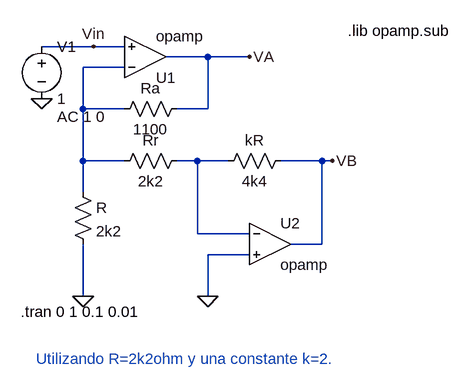
[diagram p0: schematic EJ3.asc]
EJ3.asc, the LTspice schematic file:
Version 4
SHEET 1 880 680
WIRE 96 48 16 48
WIRE 144 48 96 48
WIRE 272 64 208 64
WIRE 336 64 272 64
WIRE 144 80 80 80
WIRE 80 144 80 80
WIRE 144 144 80 144
WIRE 272 144 272 64
WIRE 272 144 224 144
WIRE 80 224 80 144
WIRE 144 224 80 224
WIRE 256 224 224 224
WIRE 304 224 256 224
WIRE 448 224 384 224
WIRE 464 224 448 224
WIRE 80 272 80 224
WIRE 256 336 256 224
WIRE 336 336 256 336
WIRE 448 352 448 224
WIRE 448 352 400 352
WIRE 336 368 272 368
WIRE 80 432 80 352
WIRE 272 432 272 368
FLAG 16 128 0
FLAG 80 432 0
FLAG 272 432 0
FLAG 96 48 Vin
FLAG 336 64 VA
FLAG 464 224 VB
SYMBOL OpAmps\\opamp 176 128 M180
SYMATTR InstName U1
SYMBOL OpAmps\\opamp 368 288 R0
SYMATTR InstName U2
SYMBOL res 240 128 R90
WINDOW 0 0 56 VBottom 2
WINDOW 3 32 56 VTop 2
SYMATTR InstName Ra
SYMATTR Value 1100
SYMBOL res 240 208 R90
WINDOW 0 0 56 VBottom 2
WINDOW 3 32 56 VTop 2
SYMATTR InstName Rr
SYMATTR Value 2k2
SYMBOL res 64 256 R0
SYMATTR InstName R
SYMATTR Value 2k2
SYMBOL res 400 208 R90
WINDOW 0 0 56 VBottom 2
WINDOW 3 32 56 VTop 2
SYMATTR InstName kR
SYMATTR Value 4k4
SYMBOL voltage 16 32 R0
WINDOW 123 24 124 Left 2
WINDOW 39 0 0 Left 0
SYMATTR InstName V1
SYMATTR Value 1
SYMATTR Value2 AC 1 0
TEXT 488 24 Left 2 !.lib opamp.sub
TEXT -16 456 Left 2 !.tran 0 1 0.1 0.01
TEXT 8 528 Left 2 ;Utilizando R=2k2ohm y una constante k=2.

The netlist it stands for:
* EJ3.asc
XU1 N001 Vin VA opamp Aol=100K GBW=10Meg  ; pins invin noninvin out
XU2 N002 0 VB opamp Aol=100K GBW=10Meg  ; pins invin noninvin out
Ra VA N001 1100
Rr N002 N001 2k2
R N001 0 2k2
R§kR VB N002 4k4
V1 Vin 0 1 AC 1 0
.lib opamp.sub
.tran 0 1 0.1 0.01
* Utilizando R=2k2ohm y una constante k=2.
.backanno
.end